# Altium schematic sheet 17-Led.SchDoc
size A4
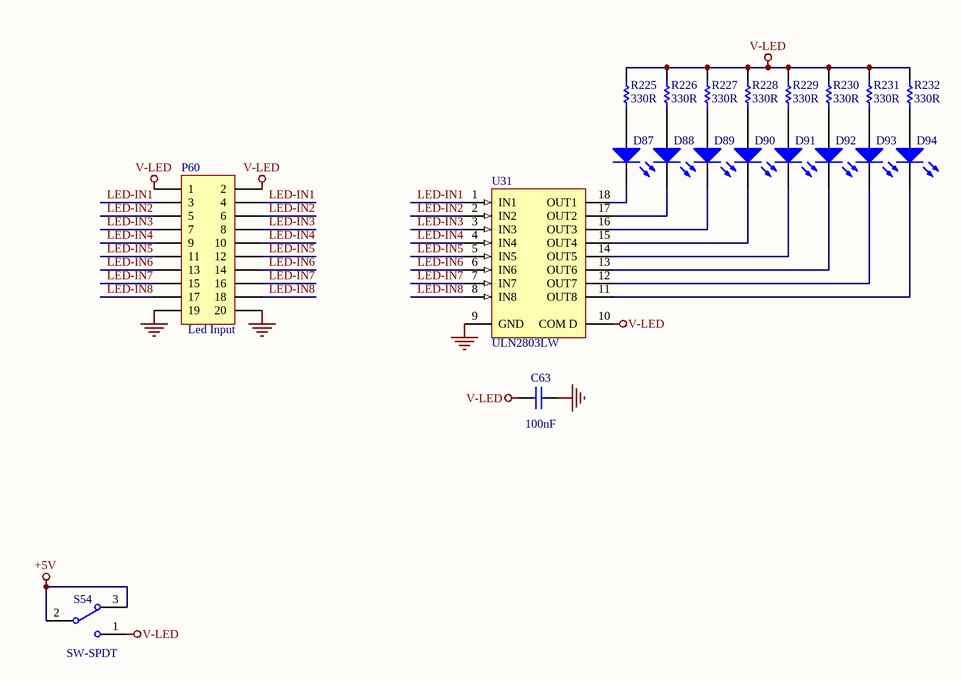
[diagram p0: 17-Led.SchDoc]

## Parts
C63  value 100nF  [C-0805]  (hidden comment: 104)
D87  LED  [LED-3528]  (value not drawn)
D88  LED  [LED-3528]  (value not drawn)
D89  LED  [LED-3528]  (value not drawn)
D90  LED  [LED-3528]  (value not drawn)
D91  LED  [LED-3528]  (value not drawn)
D92  LED  [LED-3528]  (value not drawn)
D93  LED  [LED-3528]  (value not drawn)
D94  LED  [LED-3528]  (value not drawn)
P60  value Led Input  [HDR2X10]  (hidden comment: H10X2)
R225  330R  [R-0805]
R226  330R  [R-0805]
R227  330R  [R-0805]
R228  330R  [R-0805]
R229  330R  [R-0805]
R230  330R  [R-0805]
R231  330R  [R-0805]
R232  330R  [R-0805]
S54  SW-SPDT  [SW-DIP1SMD]
U31  ULN2803LW  [sop-18]

## Nets
+5V: S54.2 S54.3
GND: C63.2 P60.19 P60.20 U31.9(GND)
V-LED: C63.1 P60.1 P60.2 R225.2 R226.2 R227.2 R228.2 R229.2 R230.2 R231.2 R232.2 S54.1 U31.10(COM_D)
LED-IN1: P60.3 P60.4 U31.1(IN1)
LED-IN2: P60.5 P60.6 U31.2(IN2)
LED-IN3: P60.7 P60.8 U31.3(IN3)
LED-IN4: P60.9 P60.10 U31.4(IN4)
LED-IN5: P60.11 P60.12 U31.5(IN5)
LED-IN6: P60.13 P60.14 U31.6(IN6)
LED-IN7: P60.15 P60.16 U31.7(IN7)
LED-IN8: P60.17 P60.18 U31.8(IN8)
NetD87_1: D87.1(A) R225.1
NetD87_2: D87.2(K) U31.18(OUT1)
NetD88_1: D88.1(A) R226.1
NetD88_2: D88.2(K) U31.17(OUT2)
NetD89_1: D89.1(A) R227.1
NetD89_2: D89.2(K) U31.16(OUT3)
NetD90_1: D90.1(A) R228.1
NetD90_2: D90.2(K) U31.15(OUT4)
NetD91_1: D91.1(A) R229.1
NetD91_2: D91.2(K) U31.14(OUT5)
NetD92_1: D92.1(A) R230.1
NetD92_2: D92.2(K) U31.13(OUT6)
NetD93_1: D93.1(A) R231.1
NetD93_2: D93.2(K) U31.12(OUT7)
NetD94_1: D94.1(A) R232.1
NetD94_2: D94.2(K) U31.11(OUT8)

## Library data of the parts
C63 = Cap: Capacitor; Published: 8-Jun-2000; LatestRevisionDate: 17-Jul-2002; LatestRevisionNote: Re-released for DXP Platform.; PackageReference: RAD-0.3; Publisher: Altium Limited; PackageDescription: Radial Cap, Thru-Hole; 2 Leads; 0.3 in Pin Spacing
D87-D94 = LED2: Typical RED, GREEN, YELLOW, AMBER GaAs LED; Published: 8-Jun-2000; LatestRevisionDate: 17-Jul-2002; LatestRevisionNote: Re-released for DXP Platform.; PackageVersion: Feb-2002; PackageReference: 3.2X1.6X1.1; Publisher: Altium Limited; PackageDescription: SM LED; 2 Flat Leads
P60 = Header 10X2: Header, 10-Pin, Dual row; LatestRevisionDate: 17-Jul-2002; LatestRevisionNote: Re-released for DXP Platform.
R225-R232 = Res1: Resistor; Published: 8-Jun-2000; LatestRevisionDate: 17-Jul-2002; LatestRevisionNote: Re-released for DXP Platform.; PackageReference: AXIAL-0.3; Publisher: Altium Limited; PackageDescription: Axial Device, Thru-Hole; 2 Leads; 0.3 in Pin Spacing; Value: 330R
S54 = SW-SPDT: SPDT Subminiature Toggle Switch, Right Angle Mounting, Vertical Actuation; Published: 24-Mar-1999; LatestRevisionDate: 17-Dec-2003; LatestRevisionNote: Schematic revised, PCB Footprint replaced.; DatasheetVersion: 05-Dec-2000; PackageReference: TL36WW15050; Publisher: Altium Limited; PackageDescription: Switch; 4 Leads; ComponentLink1Description: Manufacturer Link; ComponentLink1URL: http://www.apem.com
U31 = ULN2803LW: High-Voltage, High-Current Darlington Array; Published: 13-Oct-2000; LatestRevisionDate: 13-Apr-2006; LatestRevisionNote: IPC-7351 Footprint Added.; DatasheetVersion: 1999; PackageReference: LW18; Publisher: Altium Limited; PackageDescription: 18-Pin Small Outline Integrated Circuit 1.27 mm Pitch; Code_JEDEC: MS-013-AB; ComponentLink1Description: Manufacturer Link; ComponentLink1URL: http://www.allegromicro.com/